# Altium schematic sheet dc_mini_fan_controller.SchDoc
size A; SheetNumber: 1; SheetTotal: 1
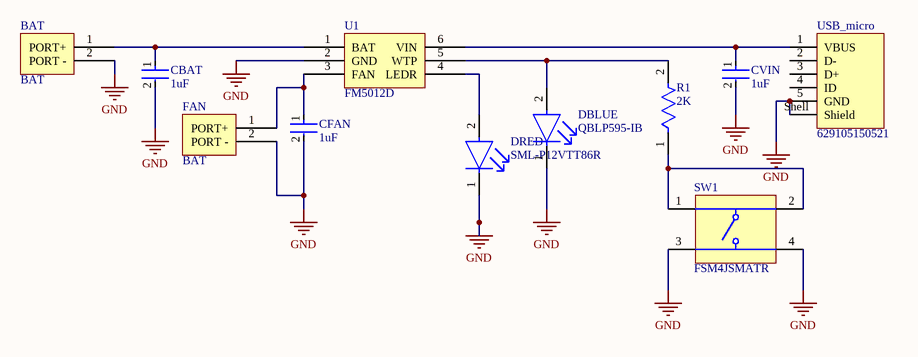
[diagram p0: dc_mini_fan_controller.SchDoc]

## Parts
BAT  BAT  [BAT]
CBAT  1uF  [FP-GRM15-0_1-MFG]
CFAN  1uF  [FP-GRM15-0_1-MFG]
CVIN  1uF  [FP-GRM15-0_1-MFG]
DBLUE  QBLP595-IB  [FP-QBLP595-IB-MFG]
DRED  SML-P12VTT86R  [FP-SML-P1-MFG]
FAN  BAT  [BAT]
R1  2K  [FP-ERJ2RK-MFG]
SW1  FSM4JSMATR  [TECO-FSM4JSMATR_V]
U1  FM5012D  [FM5012D]
USB_micro  629105150521  [629105150521]

## Nets
GND: BAT.2(PORT_-) CBAT.2 CFAN.2 CVIN.2 DBLUE.1(C) DRED.1(C) FAN.2(PORT_-) SW1.3 SW1.4 U1.2(GND) USB_micro.5(GND) USB_micro.Shell(Shield)
NetBAT_1: BAT.1(PORT+) CBAT.1 U1.1(BAT)
NetCFAN_1: CFAN.1 FAN.1(PORT+) U1.3(FAN)
NetCVIN_1: CVIN.1 U1.6(VIN) USB_micro.1(VBUS)
NetDBLUE_2: DBLUE.2(A) R1.2 U1.5(WTP)
NetDRED_2: DRED.2(A) U1.4(LEDR)
NetR1_1: R1.1 SW1.1 SW1.2

Not connected (* = marked no-connect by the designer): USB_micro 2(D-) 3(D+) 4(ID)

## Library data of the parts
CBAT CFAN CVIN = CMP-2008-04556-2: CAP CER 1UF 10V X5R 0402; Manufacturer Part Number: GRM155R61A105KE15D; Manufacturer: Murata; Tolerance: 10%; Temperature Coefficient: 15%; Description: 1µF ±10% 10V Ceramic Capacitor X5R 0402 (1005 Metric); Octopart: https://octopart.com/grm155r61a105ke15d-murata-197442; Lead Free: Yes; ComponentLink2Description: Datasheet; Temperature: -55°C to +85°C; Temperature Range High: +85°C; Height: 0.55mm; Capacitance: 1uF; Ipc Land Pattern Name: CAPC10050X50; ComponentLink2URL: https://search.murata.co.jp/Ceramy/image/img/A01X/G101/ENG/GRM155R61A105KE15-01A.pdf; Temperature Range Low: -55°C; Device Class L2: Capacitors; Voltage Rating: 10V; RoHS: TRUE; Device Class L1: Passive Components; Device Class L3: Ceramic Capacitors; Temperature Characteristic: X5R; Material: Ceramic; Mouser Description: 0402 1 uF 10 V ±10% Tolerance X5R Surface Mount Multilayer Ceramic Capacitor; Automotive: No; Package: GRM15-0.1; Digikey Description: CAP CER 1UF 10V X5R 0402; Value: 1uF; Category: Cap
DBLUE = CMP-113271-000002-1: LED BLUE CLEAR 0402 SMD; Lens Size: 0.5mm; Dominant Wavelength: 465nm; Forward Voltage: 3.1V; Lens Color: Colorless; Luminous Intensity: 85mcd; Test Current: 20mA; Viewing Angle: 140°; Lens Style: Flat; Width: 0.5mm; Case Code (Metric): 1005; Lens Transparency: Clear; Color: Blue; Packaging: Tape and Reel; Case Code (Imperial): 0402; Mount: Surface Mount; Length: 1mm; Case/Package: 0402; Height: 0.6mm
DRED = CMP-08952-000002-1: LED RED CLEAR 0402 SMD; Manufacturer: Rohm; Description: Red 630nm LED Indication - Discrete 2V 0402 (1006 Metric); Wavelength: 630nm; Luminous Intensity: 60mcd; Led Orientation: Top View; Forward Current: 20mA; Reverse Voltage: 5V; Power Dissipation: 50mW; Forward Voltage: 2V; Mouser Description: SML-P1 Series Red 0402 Clear 60 mcd 2V Surface Mount PICOLED? LED; Package: SML-P1; Colour: Red; Temperature Range Low: -40°C; Octopart: https://octopart.com/sml-p12vtt86r-rohm-34112315; Automotive: No; Temperature: -40°C to +85°C; Digikey Description: LED RED CLEAR 0402 SMD; ComponentLink2URL: https://www.rohm.com/datasheet/SML-P12VT(R)/sml-p1-e; Device Class L1: Optoelectronics; Device Class L3: unset; Category: Diode; Temperature Range High: +85°C; ComponentLink2Description: Datasheet; Lead Free: Yes; Manufacturer Part Number: SML-P12VTT86R; RoHS: TRUE; Device Class L2: LEDs; Height: 0.25mm
R1 = CMP-2002-00758-4: RES SMD 2K OHM 1% 1/10W 0402; Temperature Coefficient: 100ppm/°C; Max Power Dissipation: 100mW; Working Voltage: 50V; Resistance: 2kR; Number of Terminations: 2; Technology: THICK FILM; Packaging: Tape and Reel; RoHS Compliant: Yes; Min Operating Temperature: -55°C; Length: 1mm; Construction: Rectangular; Features: Automotive AEC-Q200; Contact Plating: Tin; Lead Free: Lead Free; Series: ERJ; Power Rating: 100mW; REACH SVHC: No SVHC; Resistor Type: Thick Film; Max Operating Temperature: 155°C; Package Quantity: 10000; Height: 0.35mm; Case/Package: 0402; Tolerance: 1%; Mount: Surface Mount; Termination: SMD/SMT; Resistance Tolerance: 1%; Depth: 0.5mm; Voltage Rating (DC): 50V; Voltage Rating: 50V; Case Code (Imperial): 0402; Military Standard: Not; Width: 0.02inch; Radiation Hardening: No; Case Code (Metric): 1005
SW1 = CMP-2000-07486-1: Micro Miniature Push Button Switch FSM JSM, 50 mA, -35 to 85 degC, 4-Pin SMD, RoHS, Tape and Reel; Manufacturer: TE Connectivity; Mechanical Life: 100000Cycles; Current Rating: 50mA; Actuator Material: Polyamide; Max Voltage Rating (DC): 12V; Capacitance: 0f; Illumination Type: Illuminated; Voltage Rating (DC): 24V; Case\/Package: SMD/SMT; Operating Force: 160gf; Contact Resistance: 100mOhm; Actuator Length: 0.055inch; Switch Travel: 0.25mm; Throw Configuration: SPST; Termination: GullWing; Contact Plating: Silver; Orientation: Straight; Mounting Technology: SurfaceMount; REACH SVHC: Unknown; Electrical Life: 100000Cycles; Package Reference: FSM4JSMATR; Max Operating Temperature: 85degC; Manufacturer URL: http://www.te.com/; Package Description: 4-Pin Surface Mount Device, Body 6 x 6 mm, Pitch 4.5 mm; Datasheet Version: Rev. V, 02/2015; Packaging: TapeandReel; Min Operating Temperature: -35degC; Mount: SurfaceMount; Contact Current Rating: 50mA; Contact Material: CopperAlloy; Package Quantity: 1200; Datasheet URL: http://www.te.com/commerce/DocumentDelivery/DDEController?Action=showdoc&DocId=Customer+Drawing%7F2-1437565-7%7FV%7Fpdf%7FEnglish%7FENG_CD_2-1437565-7_V.pdf%7F4-1437565-2; RoHSCompliant: true
U1 = FM5012D: SOT23-6
USB_micro = CMP-1502-03252-3: NexarPartId: 52645113; Number of Contacts: 5; Contact Resistance: 30mΩ; Connector Type: USB; Voltage Rating: 30V; Current Rating: 3A; USB Standard: USB 2.0; Gender: Receptacle; Insulation Resistance: 1GΩ; Height: 2.86mm; REACH SVHC: Unknown; RoHS: Compliant; Features: Shielded; Termination: SMD/SMT; Number of Pins: 5; Contact Plating: Gold; Packaging: Tape and Reel; Contact Material: Gold; Mount: Horizontal, Surface Mount; Max Operating Temperature: 85°C; Lead Free: Lead Free; Min Operating Temperature: -40°C; Orientation: Horizontal; Operating Supply Voltage: 30V